# Altium schematic sheet Opamp.SchDoc
size A4; SheetNumber: 2; SheetTotal: 5
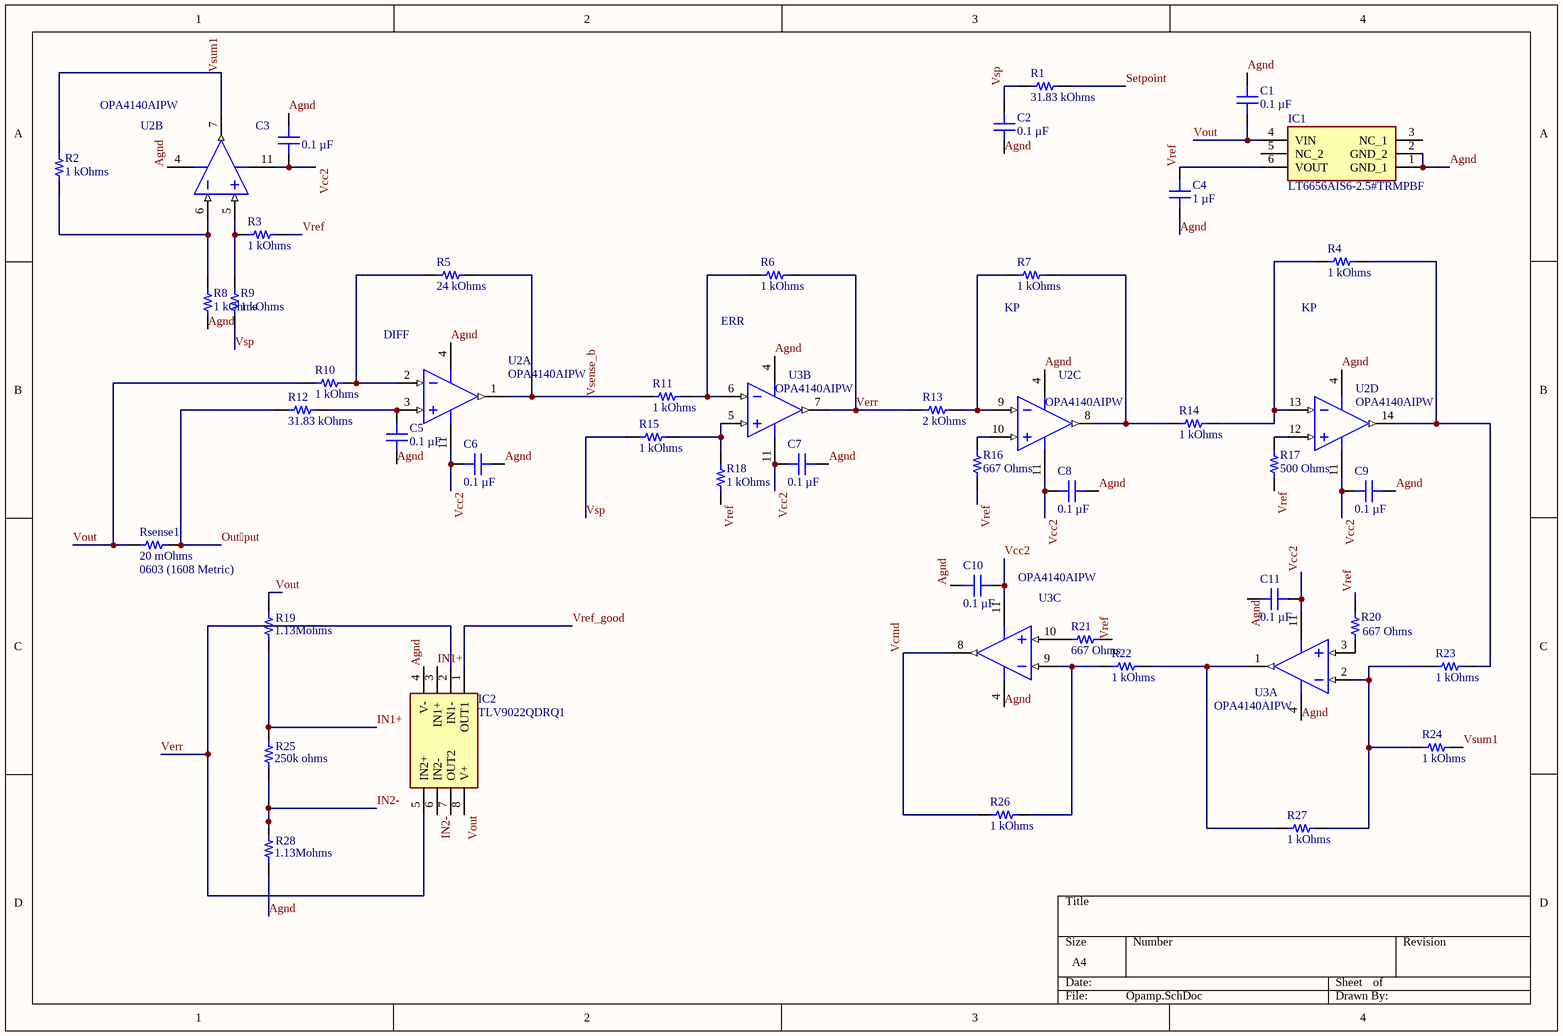
[diagram p0: Opamp.SchDoc]

## Parts
C1  0.1 µF  [CAP 0603_1608]
C2  0.1 µF  [CAP 0603_1608]
C3  0.1 µF  [CAP 0603_1608]
C4  1 µF  [CAP 0603_1608]
C5  0.1 µF  [CAP 0603_1608]
C6  0.1 µF  [CAP 0603_1608]
C7  0.1 µF  [CAP 0603_1608]
C8  0.1 µF  [CAP 0603_1608]
C9  0.1 µF  [CAP 0603_1608]
C10  0.1 µF  [CAP 0603_1608]
C11  0.1 µF  [CAP 0603_1608]
IC1  LT6656AIS6-2.5#TRMPBF  [SOT95P280X100-6N]
IC2  TLV9022QDRQ1  [SOIC127P600X175-8N]
R1  31.83 kOhms  [RES 0603_1608]
R2  1 kOhms  [RES 0603_1608]
R3  1 kOhms  [RES 0603_1608]
R4  1 kOhms  [RES 0603_1608]
R5  24 kOhms  [RES 0603_1608]
R6  1 kOhms  [RES 0603_1608]
R7  1 kOhms  [RES 0603_1608]
R8  1 kOhms  [RES 0603_1608]
R9  1 kOhms  [RES 0603_1608]
R10  1 kOhms  [RES 0603_1608]
R11  1 kOhms  [RES 0603_1608]
R12  31.83 kOhms  [RES 0603_1608]
R13  2 kOhms  [RES 0603_1608]
R14  1 kOhms  [RES 0603_1608]
R15  1 kOhms  [RES 0603_1608]
R16  667 Ohms  [RES 0603_1608]
R17  500 Ohms  [RES 0603_1608]
R18  1 kOhms  [RES 0603_1608]
R19  1.13Mohms  [RES 0603_1608]
R20  667 Ohms  [RES 0603_1608]
R21  667 Ohms  [RES 0603_1608]
R22  1 kOhms  [RES 0603_1608]
R23  1 kOhms  [RES 0603_1608]
R24  1 kOhms  [RES 0603_1608]
R25  250k ohms  [RES 0603_1608]
R26  1 kOhms  [RES 0603_1608]
R27  1 kOhms  [RES 0603_1608]
R28  1.13Mohms  [RES 0603_1608]
Rsense1  20 mOhms  Package / Case: 0603 (1608 Metric)  [STACKPOLE CSR0603]
U2  OPA4140AIPW  [PW0014A_L]  (parts A,B,C,D of 4)
U3  OPA4140AIPW  [PW0014A_L]  (parts A,B,C of 4)

## Nets
Agnd: C1.1 C2.2 C3.1 C4.2 C5.2 C6.1 C7.1 C8.1 C9.1 C10.1 C11.1 IC1.1(GND_1) IC1.2(GND_2) IC2.4(V-) R8.2 R28.2 U2.4(V+) U3.4(V+)
IN1+: IC2.3(IN1+) R19.2 R25.1
IN2-: IC2.6(IN2-) R25.2 R28.1
Output: R12.2 Rsense1.1
Setpoint: R1.1
Vcc2: C3.2 C6.2 C7.2 C8.2 C9.2 C10.2 C11.2 U2.11(V-) U3.11(V-)
Vcmd: R26.1 U3.8(OUT_C)
Verr: IC2.2(IN1-) IC2.5(IN2+) R6.1 R13.2 U3.7(OUT_B)
Vout: C1.2 IC1.4(VIN) IC2.8(V+) R10.2 R19.1 Rsense1.2
Vref: C4.1 IC1.6(VOUT) R3.2 R16.1 R17.1 R18.2 R20.2 R21.2
Vref_good: IC2.1(OUT1)
Vsense_b: R5.2 R11.2 U2.1(OUT_A)
Vsp: C2.1 R1.2 R9.2 R15.2
Vsum1: R2.1 R24.2 U2.7(OUT_B)
NetC5_1: C5.1 R12.1 U2.3(IN_A+)
NetR2_2: R2.2 R8.1 U2.6(IN_B-)
NetR3_1: R3.1 R9.1 U2.5(IN_B+)
NetR4_1: R4.1 R23.2 U2.14(OUT_D)
NetR4_2: R4.2 R14.1 U2.13(IN_D-)
NetR5_1: R5.1 R10.1 U2.2(IN_A-)
NetR6_2: R6.2 R11.1 U3.6(IN_B-)
NetR7_1: R7.1 R14.2 U2.8(OUT_C)
NetR7_2: R7.2 R13.1 U2.9(IN_C-)
NetR15_1: R15.1 R18.1 U3.5(IN_B+)
NetR16_2: R16.2 U2.10(IN_C+)
NetR17_2: R17.2 U2.12(IN_D+)
NetR20_1: R20.1 U3.3(IN_A+)
NetR21_1: R21.1 U3.10(IN_C+)
NetR22_1: R22.1 R26.2 U3.9(IN_C-)
NetR22_2: R22.2 R27.1 U3.1(OUT_A)
NetR23_1: R23.1 R24.1 R27.2 U3.2(IN_A-)

Not connected (* = marked no-connect by the designer): IC1 3(NC_1) 5(NC_2); IC2 7(OUT2)

## Notes on the sheet
- (near R7) KP
- (near R4) KP
- (near U2) DIFF
- ERR

## Library data of the parts
C1-C3 C5-C11 = C0603C104K5RAC7411: CAP CER 0.1UF 50V X7R 0603; manufacturer: KEMET; Tolerance: ±10%; Part Number: C0603C104K5RAC7411; Value: 0.1 µF; Applications: Bypass, Decoupling; Capacitance: 0.1 µF; componentlink1description: Datasheet; componentlink1url: https://api.kemet.com/component-edge/download/datasheet/C0603C104K5RAC7411.pdf; componentlink2description: DigiKey Link; componentlink2url: https://www.digikey.com/en/products/detail/kemet/C0603C104K5RAC7411/3317013; Device Package: 0603 (1608 Metric); lastupdated: 10-07-2023 19:07:57; Lifecycle Status: Active; Minimum Order: 1; Mounting Type: Surface Mount, MLCC; Operating Temperature: -55°C ~ 125°C; Package / Case: 0603 (1608 Metric); packaging: TapeAndReel; partid: 2233; Part Status: Active; price: 0.01; series: SMD Comm X7R; Size / Dimension: 0.063" L x 0.031" W (1.60mm x 0.80mm); Supplier 1: DigiKey; Supplier Part Number 1: 399-C0603C104K5RAC7411CT-ND; Temperature Coefficient: X7R; Thickness (Max): 0.035" (0.90mm); Voltage - Rated: 50V
C4 = C0603C105K4RACAUTO: CAP CER 1UF 16V X7R 0603; manufacturer: KEMET; Tolerance: ±10%; Part Number: C0603C105K4RACAUTO; Value: 1 µF; Applications: Automotive, Bypass, Decoupling; Capacitance: 1 µF; componentlink1description: Datasheet; componentlink1url: https://api.kemet.com/component-edge/download/datasheet/C0603C105K4RACAUTO.pdf; componentlink2description: DigiKey Link; componentlink2url: https://www.digikey.com/en/products/detail/kemet/C0603C105K4RACAUTO/8635831; Device Package: 0603 (1608 Metric); lastupdated: 11-07-2023 19:07:50; Lifecycle Status: Active; Minimum Order: 1; Mounting Type: Surface Mount, MLCC; Operating Temperature: -55°C ~ 125°C; Package / Case: 0603 (1608 Metric); packaging: TapeAndReel; partid: 2179; Part Status: Active; price: 0.01; Ratings: AEC-Q200; series: SMD Auto X7R; Size / Dimension: 0.063" L x 0.031" W (1.60mm x 0.80mm); Supplier 1: DigiKey; Supplier Part Number 1: 399-17704-1-ND; Temperature Coefficient: X7R; Thickness (Max): 0.037" (0.95mm); Voltage - Rated: 16V
IC1 = LT6656AIS6-2.5#TRMPBF: Integrated Circuit; Manufacturer_Name: Analog Devices; Datasheet Link: https://datasheet.datasheetarchive.com/originals/distributors/Datasheets_SAMA/d53d0df16fa3c9e3cd0282524dab6a3f.pdf; Height: 1mm; Manufacturer_Part_Number: LT6656AIS6-2.5#TRMPBF; Mouser Part Number: 584-6656AIS6-2.5TMPF; Mouser Price/Stock: https://www.mouser.co.uk/ProductDetail/Analog-Devices/LT6656AIS6-25TRMPBF?qs=hVkxg5c3xu%252BJt7EHt6GCkQ%3D%3D; Arrow Part Number: LT6656AIS6-2.5#TRMPBF; Arrow Price/Stock: https://www.arrow.com/en/products/lt6656ais6-2.5trmpbf/analog-devices?region=nac
IC2 = TLV9022QDRQ1: Integrated Circuit; Manufacturer_Name: Texas Instruments; Datasheet Link: https://www.ti.com/lit/gpn/tlv9022-q1; Height: 1.75mm; Manufacturer_Part_Number: TLV9022QDRQ1; Mouser Part Number: 595-TLV9022QDRQ1; Mouser Price/Stock: https://www.mouser.co.uk/ProductDetail/Texas-Instruments/TLV9022QDRQ1?qs=IS%252B4QmGtzzpc3yG5MWnOYA%3D%3D
R1-R28 = RNCS0603BKE10K0: RES 10K OHM 0.1% 1/16W 0603; Manufacturer: Stackpole Electronics Inc; Power (Watts): 0.063W, 1/16W; Resistance: 10 kOhms; Temperature Coefficient: ±25ppm/°C; Part Number: RNCS0603BKE10K0; ComponentLink1Description: Datasheet; ComponentLink1URL: https://www.seielect.com/catalog/sei-rncs_rnch.pdf; ComponentLink2Description: DigiKey Link; ComponentLink2URL: https://www.digikey.com/en/products/detail/stackpole-electronics-inc/RNCS0603BKE10K0/1708836; Composition: Thin Film; Device Package: 0603 (1608 Metric); Features: Anti-Corrosive, Automotive AEC-Q200, Moisture Resistant; Height - Seated (Max): 0.022" (0.55mm); LastUpdated: 10-07-2023 19:34:07; Lifecycle Status: Active; Minimum Order: 1; Number of Terminations: 2; Operating Temperature: -55°C ~ 155°C; Package / Case: 0603 (1608 Metric); Packaging: TapeAndReel; PartId: 4838; Part Status: Active; Price: 0.07; Ratings: AEC-Q200; Series: RNCS; Size / Dimension: 0.061" L x 0.031" W (1.55mm x 0.80mm); Supplier 1: DigiKey; Supplier Part Number 1: RNCS0603BKE10K0CT-ND; Supplier Device Package: 0603; Tolerance: ±0.1%
  R1 R12: Value: 31.83 kOhms
  R2-R4 R6-R11 R14 R15 R18 R22-R24 R26 R27: Value: 1 kOhms
  R5: Value: 24 kOhms
  R13: Value: 2 kOhms
  R16 R20 R21: Value: 667 Ohms
  R17: Value: 500 Ohms
  R19 R28: Value: 1.13Mohms
  R25: Value: 250k ohms
Rsense1 = LVT06R0200FER: RES 0.02 OHM 1% 1/3W 0603; Manufacturer: Ohmite; Power (Watts): 0.333W, 1/3W; Temperature Coefficient: ±100ppm/°C; Part Number: LVT06R0200FER; ComponentLink1Description: Datasheet; ComponentLink1URL: https://www.ohmite.com/assets/docs/res_lvt.pdf?r=false; ComponentLink2Description: DigiKey Link; ComponentLink2URL: https://www.digikey.com/en/products/detail/ohmite/LVT06R0200FER/9556148; Composition: Metal Element; Device Package: 0603 (1608 Metric); Features: Current Sense; Height - Seated (Max): 0.026" (0.65mm); LastUpdated: 07-07-2023 20:03:13; Lifecycle Status: Active; Minimum Order: 1; Number of Terminations: 2; Operating Temperature: -55°C ~ 155°C; Packaging: TapeAndReel; PartId: 560; Part Status: Active; Price: 0.11; Resistance: 20 mOhms; Series: LVT; Size / Dimension: 0.063" L x 0.031" W (1.60mm x 0.80mm); Supplier 1: DigiKey; Supplier Part Number 1: LVT06R0200FERCT-ND; Supplier Device Package: 0603; Tolerance: ±1%; Value: 20 mOhms
U2 U3 = CMP-0272-01663-3: 11 MHz, Single Supply, Low Noise, Precision, Rail-to-Rail Output, JFET Amplifier, 4.5 to 36 V, -40 to 125 degC, 14-pin SOP (PW14), Green (RoHS & no Sb/Br); Manufacturer: Texas Instruments; Number of Channels: 4; Sub Family: High Supply Voltage Amplifier (>=30V), Low Input Bias Current Amp (<=10pA), Low Noise Amp (<=10nV/rtHz), Low Offset Voltage Amplifier (<=500uV), Precision Amplifier; CMRR(Min)(dB): 126; Packing: BULK; Offset Drift(Typ)(uV/C): 0.35; Iq per channel(Max)(mA): 2; Rating: Catalog; Total Supply Voltage(Min)(+5V is 5, +/-5V is 10): 4.5; Total Supply Voltage(Max)(+5V is 5, +/-5V is 10): 36; IIB(Max)(pA): 10; Vio (25C)(Max)(mV): 0.12; GBW(Typ)(MHz): 11; Slew Rate(Typ)(V/us): 20; Code_JEDEC: MO-153; ComponentLink3URL: http://www.ti.com/litv/pdf/mpds360; ComponentLink1URL: http://www.ti.com/; Mounting Technology: Surface Mount; Eco-Plan: Green (RoHS & no Sb/Br); PackageReference: PW0014A; ComponentLink1Description: Manufacturer URL; ComponentLink2Description: Datasheet; PackageVersion: 4040064-3/G, 02/2011; PackageDescription: 14-Pin Plastic Small Outline, Body 5 x 4.4 mm, Pitch 0.65 mm; ComponentLink3Description: Package Specification; DatasheetVersion: SBOS498A; ComponentLink2URL: http://www.ti.com/lit/ds/symlink/opa4140.pdf; PartNumber: OPA4140AIPW